# Altium project bailey.PrjPcb (part 11 of 11)
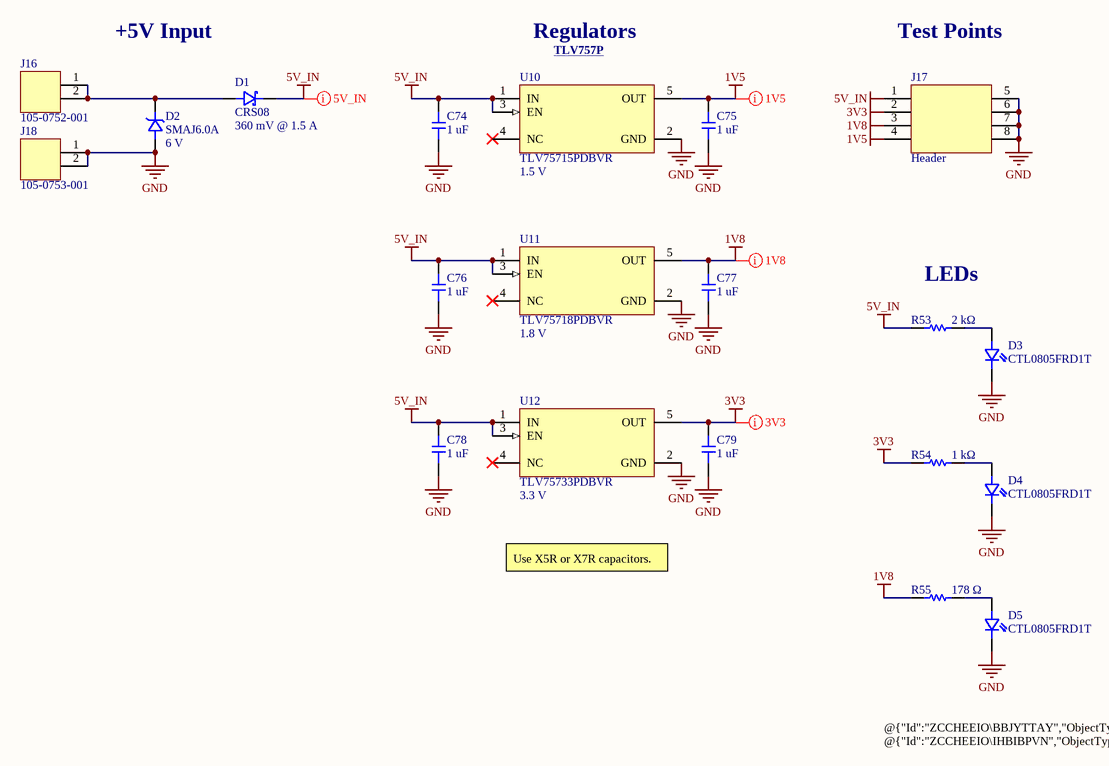
[diagram p15: POWER.SchDoc]

## Sheet POWER.SchDoc (continued)

### Library data of the parts (continued)
U11 = TLV75718PDBVR: 1-A, low-IQ high-accuracy low-dropout (LDO) voltage regulator with enable 5-SOT-23 -40 to 125; Manufacturer: Texas Instruments; Manufacturer Lifecycle Status: ACTIVE; Output Current: 1 A; Accuracy: 1%; Dropout Voltage: 650mV; Max Junction Temperature (Tj): 125°C; Max Supply Voltage: 5.5V; Min Supply Voltage: 1.45V; Nominal Supply Current: 25µA; Number of Channels: 1; Manufacturer Part Number: TLV75718PDBVR; Supplier: DigiKey; Supplier Part Number: 296-50413-1-ND; RoHS: Compliant; Category: LDO Voltage Regulators; Stock: 12647; Pricing: 1=0.33, 10=0.229, 25=0.2032, 100=0.1751, 250=0.16168, 500=0.15358, 1000=0.14692 (USD); Case/Package: SOT-23; Height: 1.45mm; Length: 2.9mm; Lifecycle Status: Production; Max Operating Temperature: 125°C; Min Operating Temperature: -40°C; Number of Outputs: 1; Pins: 5; Schedule B: 8542390000, 8542390000|8542390000|8542390000|8542390000|8542390000; Thickness: 1.2mm; Width: 1.6mm; ComponentLink1URL: https://sigma.octopart.com:443/177332311/technical_drawing/Texas-Instruments-TLV75718PDBVR.pdf?src-supplier=Texas+Instruments; ComponentLink1Description: https://sigma.octopart.com:443/177332311/technical_drawing/Texas-Instruments-TLV75718PDBVR.pdf?src-supplier=Texas+Instruments; ComponentLink2URL: https://octopart.com:443/opatz8j6/c1?t=LNhw8VYZlWpvSgfwSbWwER0C1aFrb4WiDbvbIAGvhxvgQJSu-YTHIYusHOkqrFl1ubYiC7hECb41naNFPdUxKtCiz9_QYZXvTPuT2kWWY7P1iaj_9VuZ0VXU-pOF7midcWATfFw5vckxfwAqZx9Q2ej4q7wKDFH9Xtp9E58D2pRmx7nz-A2MSPhDRcBhv6VVNe5pwxWdv5qqQWIE0Ip5EXAq_TZ793t-Km77zPzDy5oRrzSJqtrEGO8Rg9L3KNyczjw3CqQXp4IaldJF9NwqSrhLVRVV24aJWYeWxK7QEZ1zbLdzfLHpUNGWUx5BArHk98TBn7whuhePb0udLY4hessARU-N37P82AGNs8v-R6eVBy-k_l2R0DXlJserTyRNxdjxCkw&src-supplier=Texas+Instruments; ComponentLink2Description: https://octopart.com:443/opatz8j6/c1?t=LNhw8VYZlWpvSgfwSbWwER0C1aFrb4WiDbvbIAGvhxvgQJSu-YTHIYusHOkqrFl1ubYiC7hECb41naNFPdUxKtCiz9_QYZXvTPuT2kWWY7P1iaj_9VuZ0VXU-pOF7midcWATfFw5vckxfwAqZx9Q2ej4q7wKDFH9Xtp9E58D2pRmx7nz-A2MSPhDRcBhv6VVNe5pwxWdv5qqQWIE0Ip5EXAq_TZ793t-Km77zPzDy5oRrzSJqtrEGO8Rg9L3KNyczjw3CqQXp4IaldJF9NwqSrhLVRVV24aJWYeWxK7QEZ1zbLdzfLHpUNGWUx5BArHk98TBn7whuhePb0udLY4hessARU-N37P82AGNs8v-R6eVBy-k_l2R0DXlJserTyRNxdjxCkw&src-supplier=Texas+Instruments; ComponentLink3URL: https://sigma.octopart.com:443/175570406/technical_drawing/Texas-Instruments-TLV75718PDBVR.pdf?src-supplier=Texas+Instruments; ComponentLink3Description: https://sigma.octopart.com:443/175570406/technical_drawing/Texas-Instruments-TLV75718PDBVR.pdf?src-supplier=Texas+Instruments; ComponentLink4URL: https://sigma.octopart.com:443/169406034/technical_drawing/Texas-Instruments-TLV75718PDBVR.pdf?src-supplier=Texas+Instruments; ComponentLink4Description: https://sigma.octopart.com:443/169406034/technical_drawing/Texas-Instruments-TLV75718PDBVR.pdf?src-supplier=Texas+Instruments; ComponentLink5URL: https://sigma.octopart.com:443/155939316/technical_drawing/Texas-Instruments-TLV75718PDBVR.pdf?src-supplier=Texas+Instruments; ComponentLink5Description: https://sigma.octopart.com:443/155939316/technical_drawing/Texas-Instruments-TLV75718PDBVR.pdf?src-supplier=Texas+Instruments; ComponentLink6URL: https://sigma.octopart.com:443/102331370/technical_drawing/Texas-Instruments-TLV75718PDBVR.pdf?src-supplier=Texas+Instruments; ComponentLink6Description: https://sigma.octopart.com:443/102331370/technical_drawing/Texas-Instruments-TLV75718PDBVR.pdf?src-supplier=Texas+Instruments; ComponentLink7URL: https://datasheet.octopart.com:443/TLV75718PDBVR-Texas-Instruments-datasheet-151190461.pdf?src-supplier=Upverter; ComponentLink7Description: https://datasheet.octopart.com:443/TLV75718PDBVR-Texas-Instruments-datasheet-151190461.pdf?src-supplier=Upverter; ComponentLink8URL: https://datasheet.octopart.com:443/TLV75718PDBVR-Texas-Instruments-datasheet-164419132.pdf?src-supplier=Augswan; ComponentLink8Description: https://datasheet.octopart.com:443/TLV75718PDBVR-Texas-Instruments-datasheet-164419132.pdf?src-supplier=Augswan; ComponentLink9URL: https://datasheet.octopart.com:443/TLV75718PDBVR-Texas-Instruments-datasheet-165804641.pdf?src-supplier=LCSC; ComponentLink9Description: https://datasheet.octopart.com:443/TLV75718PDBVR-Texas-Instruments-datasheet-165804641.pdf?src-supplier=LCSC; ComponentLink10URL: https://datasheet.octopart.com:443/TLV75718PDBVR-Texas-Instruments-datasheet-159117837.pdf?src-supplier=LCSC; ComponentLink10Description: https://datasheet.octopart.com:443/TLV75718PDBVR-Texas-Instruments-datasheet-159117837.pdf?src-supplier=LCSC; ComponentLink11URL: http://sigma.octopart.com:80/reach_statement/Texas-Instruments-company-64.pdf?src-supplier=Compliance+Statements; ComponentLink11Description: http://sigma.octopart.com:80/reach_statement/Texas-Instruments-company-64.pdf?src-supplier=Compliance+Statements; ComponentLink12URL: http://sigma.octopart.com:80/conflict_mineral_statement/Texas-Instruments-company-63.pdf?src-supplier=Compliance+Statements; ComponentLink12Description: http://sigma.octopart.com:80/conflict_mineral_statement/Texas-Instruments-company-63.pdf?src-supplier=Compliance+Statements
U12 = TLV75733PDBVR: 1-A, low-IQ high-accuracy low-dropout (LDO) voltage regulator with enable 5-SOT-23 -40 to 125; Manufacturer: Texas Instruments; Manufacturer Lifecycle Status: ACTIVE; Output Current: 1 A; Accuracy: 1%; Dropout Voltage: 1.35V; Max Junction Temperature (Tj): 125°C; Max Supply Voltage: 5.5V; Min Supply Voltage: 1.45V; Number of Channels: 1; Manufacturer Part Number: TLV75733PDBVR; Supplier: DigiKey; Supplier Part Number: 296-50414-1-ND; RoHS: Compliant; Category: LDO Voltage Regulators; Stock: 9339; Pricing: 1=0.33, 10=0.229, 25=0.2032, 100=0.1751, 250=0.16168, 500=0.15358, 1000=0.14692 (USD); Case/Package: SOT-23; Height: 1.45mm; Length: 2.9mm; Lifecycle Status: Production; Max Operating Temperature: 125°C; Min Operating Temperature: -40°C; Number of Outputs: 1; Pins: 5; Schedule B: 8542390000, 8542390000|8542390000|8542390000|8542390000|8542390000; Thickness: 1.2mm; Width: 1.6mm; ComponentLink1URL: https://sigma.octopart.com:443/177332311/technical_drawing/Texas-Instruments-TLV75733PDBVR.pdf?src-supplier=Texas+Instruments; ComponentLink1Description: https://sigma.octopart.com:443/177332311/technical_drawing/Texas-Instruments-TLV75733PDBVR.pdf?src-supplier=Texas+Instruments; ComponentLink2URL: https://octopart.com:443/opatz8j6/c1?t=o_IEZOOxq13ZapM8h6eyVu6U4w7uJ0lOpdn1eQGus_LxPlF5140NiI_IzcwdUYrJ31K3ZwQ0inlTMb17Fre9UGVV-cyueG3giZtsqNdfBTaDvWHPrUnuYqbjGGi1Ds2698qqLwV3Tlrub6HkjX8UNxdzrCQv7HZbxbhh4yUVoxpAQ1qsH8ZXaPiP3z0geKqV9LoOfem8uzwcPRQneIzB8HlYy48TGA3XJ2QdRU4asiXFDExmiO-kVw1cCOAyjCAZDaRc6pkHeHkCvnc9-OsSmWRnTJK9cYXxUvWANDQacA2frlSUhGVJAUMlyqJStMqs6xJQSWGFCunWce9bwDnK-mHRtMdijleQcFxXiu3YZMz3tjqIGqvB3GT98ijRk5E9binYeYc&src-supplier=Texas+Instruments; ComponentLink2Description: https://octopart.com:443/opatz8j6/c1?t=o_IEZOOxq13ZapM8h6eyVu6U4w7uJ0lOpdn1eQGus_LxPlF5140NiI_IzcwdUYrJ31K3ZwQ0inlTMb17Fre9UGVV-cyueG3giZtsqNdfBTaDvWHPrUnuYqbjGGi1Ds2698qqLwV3Tlrub6HkjX8UNxdzrCQv7HZbxbhh4yUVoxpAQ1qsH8ZXaPiP3z0geKqV9LoOfem8uzwcPRQneIzB8HlYy48TGA3XJ2QdRU4asiXFDExmiO-kVw1cCOAyjCAZDaRc6pkHeHkCvnc9-OsSmWRnTJK9cYXxUvWANDQacA2frlSUhGVJAUMlyqJStMqs6xJQSWGFCunWce9bwDnK-mHRtMdijleQcFxXiu3YZMz3tjqIGqvB3GT98ijRk5E9binYeYc&src-supplier=Texas+Instruments; ComponentLink3URL: https://sigma.octopart.com:443/175570406/technical_drawing/Texas-Instruments-TLV75733PDBVR.pdf?src-supplier=Texas+Instruments; ComponentLink3Description: https://sigma.octopart.com:443/175570406/technical_drawing/Texas-Instruments-TLV75733PDBVR.pdf?src-supplier=Texas+Instruments; ComponentLink4URL: https://sigma.octopart.com:443/169406034/technical_drawing/Texas-Instruments-TLV75733PDBVR.pdf?src-supplier=Texas+Instruments; ComponentLink4Description: https://sigma.octopart.com:443/169406034/technical_drawing/Texas-Instruments-TLV75733PDBVR.pdf?src-supplier=Texas+Instruments; ComponentLink5URL: https://sigma.octopart.com:443/155939316/technical_drawing/Texas-Instruments-TLV75733PDBVR.pdf?src-supplier=Texas+Instruments; ComponentLink5Description: https://sigma.octopart.com:443/155939316/technical_drawing/Texas-Instruments-TLV75733PDBVR.pdf?src-supplier=Texas+Instruments; ComponentLink6URL: https://sigma.octopart.com:443/102331370/technical_drawing/Texas-Instruments-TLV75733PDBVR.pdf?src-supplier=Texas+Instruments; ComponentLink6Description: https://sigma.octopart.com:443/102331370/technical_drawing/Texas-Instruments-TLV75733PDBVR.pdf?src-supplier=Texas+Instruments; ComponentLink7URL: https://datasheet.octopart.com:443/TLV75733PDBVR-Texas-Instruments-datasheet-164419132.pdf?src-supplier=Augswan; ComponentLink7Description: https://datasheet.octopart.com:443/TLV75733PDBVR-Texas-Instruments-datasheet-164419132.pdf?src-supplier=Augswan; ComponentLink8URL: https://datasheet.octopart.com:443/TLV75733PDBVR-Texas-Instruments-datasheet-165804641.pdf?src-supplier=LCSC; ComponentLink8Description: https://datasheet.octopart.com:443/TLV75733PDBVR-Texas-Instruments-datasheet-165804641.pdf?src-supplier=LCSC; ComponentLink9URL: https://datasheet.octopart.com:443/TLV75733PDBVR-Texas-Instruments-datasheet-159117837.pdf?src-supplier=LCSC; ComponentLink9Description: https://datasheet.octopart.com:443/TLV75733PDBVR-Texas-Instruments-datasheet-159117837.pdf?src-supplier=LCSC; ComponentLink10URL: http://sigma.octopart.com:80/reach_statement/Texas-Instruments-company-64.pdf?src-supplier=Compliance+Statements; ComponentLink10Description: http://sigma.octopart.com:80/reach_statement/Texas-Instruments-company-64.pdf?src-supplier=Compliance+Statements; ComponentLink11URL: http://sigma.octopart.com:80/conflict_mineral_statement/Texas-Instruments-company-63.pdf?src-supplier=Compliance+Statements; ComponentLink11Description: http://sigma.octopart.com:80/conflict_mineral_statement/Texas-Instruments-company-63.pdf?src-supplier=Compliance+Statements

## Sheet MCU.SchDoc
size Letter; DrawnBy: Titan Yuan; DocumentNumber: 7; SheetNumber: 7; SheetTotal: 7
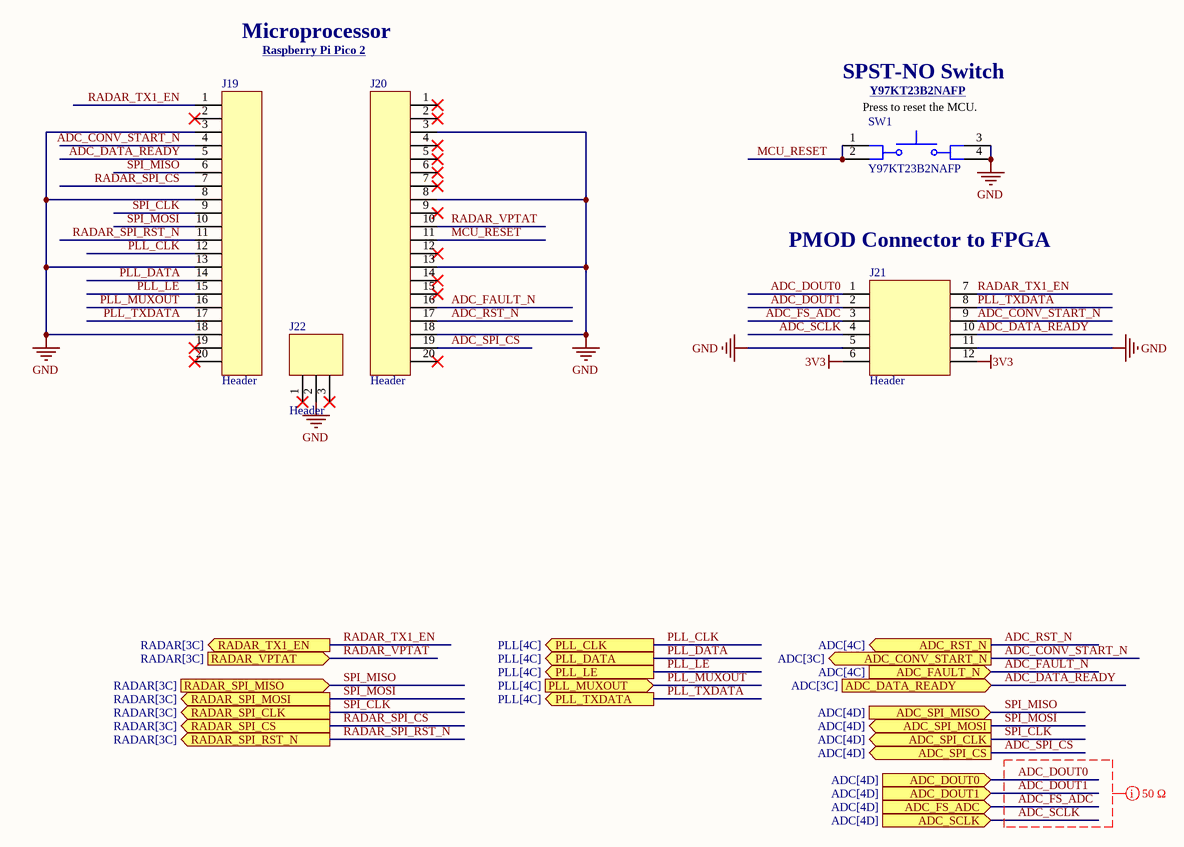
[diagram p6: MCU.SchDoc]

### Parts
J19  Header  [CONN_1x20_2.54mm_PinSocket_Vertical]
J20  Header  [CONN_1x20_2.54mm_PinSocket_Vertical]
J21  Header  [CONN_2x6_2.54mm_PinHeader_Horizontal]
J22  Header  [CONN_1x3_2.54mm_PinSocket_Vertical]
SW1  Y97KT23B2NAFP  [PTS647]

### Ports
ADC_CONV_START_N (out, see ADC[3C]), ADC_DATA_READY (in, see ADC[3C]), ADC_DOUT0 (in, see ADC[4D]), ADC_DOUT1 (in, see ADC[4D]), ADC_FAULT_N (in, see ADC[4C]), ADC_FS_ADC (in, see ADC[4D]), ADC_RST_N (out, see ADC[4C]), ADC_SCLK (in, see ADC[4D]), ADC_SPI_CLK (out, see ADC[4D]), ADC_SPI_CS (out, see ADC[4D]), ADC_SPI_MISO (in, see ADC[4D]), ADC_SPI_MOSI (out, see ADC[4D]), PLL_CLK (out, see PLL[4C]), PLL_DATA (out, see PLL[4C]), PLL_LE (out, see PLL[4C]), PLL_MUXOUT (in, see PLL[4C]), PLL_TXDATA (out, see PLL[4C]), RADAR_SPI_CLK (out, see RADAR[3C]), RADAR_SPI_CS (out, see RADAR[3C]), RADAR_SPI_MISO (in, see RADAR[3C]), RADAR_SPI_MOSI (out, see RADAR[3C]), RADAR_SPI_RST_N (out, see RADAR[3C]), RADAR_TX1_EN (out, see RADAR[3C]), RADAR_VPTAT (in, see RADAR[3C])

### Nets
3V3: J21.6 J21.12  [project net AVDD]
GND: J19.3 J19.8 J19.13 J19.18 J20.3 J20.8 J20.13 J20.18 J21.5 J21.11 J22.2 SW1.3 SW1.4
ADC_CONV_START_N: J19.4 J21.9 ; port ADC_CONV_START_N
ADC_DATA_READY: J19.5 J21.10 ; port ADC_DATA_READY
ADC_DOUT0: J21.1 ; port ADC_DOUT0
ADC_DOUT1: J21.2 ; port ADC_DOUT1
ADC_FAULT_N: J20.16 ; port ADC_FAULT_N
ADC_FS_ADC: J21.3 ; port ADC_FS_ADC
ADC_RST_N: J20.17 ; port ADC_RST_N
ADC_SCLK: J21.4 ; port ADC_SCLK
ADC_SPI_CS: J20.19 ; port ADC_SPI_CS
MCU_RESET: J20.11 SW1.1 SW1.2  [project net MCU_RESET_7]
PLL_CLK: J19.12 ; port PLL_CLK
PLL_DATA: J19.14 ; port PLL_DATA
PLL_LE: J19.15 ; port PLL_LE
PLL_MUXOUT: J19.16 ; port PLL_MUXOUT
PLL_TXDATA: J19.17 J21.8 ; port PLL_TXDATA
RADAR_SPI_CS: J19.7 ; port RADAR_SPI_CS
RADAR_SPI_RST_N: J19.11 ; port RADAR_SPI_RST_N
RADAR_TX1_EN: J19.1 J21.7 ; port RADAR_TX1_EN
RADAR_VPTAT: J20.10 ; port RADAR_VPTAT
SPI_CLK: J19.9 ; port RADAR_SPI_CLK, port ADC_SPI_CLK  [project net ADC_SPI_CLK]
SPI_MISO: J19.6 ; port RADAR_SPI_MISO, port ADC_SPI_MISO  [project net ADC_SPI_MISO]
SPI_MOSI: J19.10 ; port RADAR_SPI_MOSI, port ADC_SPI_MOSI  [project net ADC_SPI_MOSI]

Not connected (* = marked no-connect by the designer): J19 2* 19* 20*; J20 1* 2* 4* 5* 6* 7* 9* 12* 14* 15* 20*; J22 1* 3*

### Layout directives
net class 50 Ω: ADC_DOUT0, ADC_DOUT1, ADC_FS_ADC, ADC_SCLK

### Notes on the sheet
- Microprocessor
- Raspberry Pi Pico 2 <https://www.raspberrypi.com/products/raspberry-pi-pico-2/>
- SPST-NO Switch
- (near SW1) Press to reset the MCU.
- (near SW1) Y97KT23B2NAFP <https://www.ckswitches.com/media/2567/pts647.pdf>
- (near J21) PMOD Connector to FPGA

### Library data of the parts
J19 J20 = CONN_1x20_2.54mm_PinSocket_Vertical: WR-PHD 2.54 mm Socket Header; 20 pins; Manufacturer: Wurth Elektronik; Manufacturer Part Number: 61302011821; Contact Resistance: 20mΩ; Current Rating: 3A; Gender: Female; Insulation Resistance: 1GΩ; Operating Supply Voltage: 250V; Pitch: 2.54mm; Supplier: DigiKey; Supplier Part Number: 732-61302011821-ND; RoHS: Compliant; Category: Connectors; Stock: 9205; Pricing: 1=0.83, 25=0.7508, 100=0.7038, 250=0.6534, 500=0.6048, 1000=0.5058 (USD); Contact Plating: Gold; Insulation Material: PBT; Lead Pitch: 2.54mm; Length: 51.3mm; Max Operating Temperature: 105°C; Min Operating Temperature: -40°C; Pins: 20; Orientation: Vertical; ComponentLink1URL: https://datasheet.octopart.com:443/61302011821-Wurth-Elektronik-datasheet-182028588.pdf?src-supplier=Wurth+Elektronik; ComponentLink1Description: https://datasheet.octopart.com:443/61302011821-Wurth-Elektronik-datasheet-182028588.pdf?src-supplier=Wurth+Elektronik; ComponentLink2URL: https://datasheet.octopart.com:443/61302011821-W%C3%BCrth-Elektronik-datasheet-62127820.pdf?src-supplier=Wurth+Elektronik; ComponentLink2Description: https://datasheet.octopart.com:443/61302011821-W%C3%BCrth-Elektronik-datasheet-62127820.pdf?src-supplier=Wurth+Elektronik; ComponentLink3URL: https://datasheet.octopart.com:443/61302011821-W%C3%BCrth-Elektronik-datasheet-149524182.pdf?src-supplier=Farnell; ComponentLink3Description: https://datasheet.octopart.com:443/61302011821-W%C3%BCrth-Elektronik-datasheet-149524182.pdf?src-supplier=Farnell
J21 = CONN_2x6_2.54mm_PinHeader_Horizontal: Conn Unshrouded Header HDR 12 POS 2.54mm Solder RA Top Entry Thru-Hole Bag; Manufacturer: Adam Tech; Manufacturer Part Number: PH2RA-12-UA; Contact Resistance: 20mΩ; Current Rating: 3A; Insulation Resistance: 5GΩ; Supplier: DigiKey; Supplier Part Number: 2057-PH2RA-12-UA-ND; RoHS: Compliant; Category: Card Edge Connectors; Stock: 5214; Pricing: 1=0.27, 10=0.229, 100=0.1945, 500=0.17358, 1000=0.16528, 5000=0.14753, 10000=0.14049 (USD); Contact Gender: Male; Contact Material: Brass; Export Control Classification Number (ECCN) Code: EAR99; Harmonized Tariff Schedule (HTS) Code: 8536.69.40.40; Introduction Date: 2012-01-13; Lifecycle Status: Production; Max Operating Temperature: 105°C; Min Operating Temperature: -40°C; Pins: 12; Number of Rows: 2; REACH SVHC: Yes; Row Spacing: 2.54mm; Schedule B: 8536694040, 8536694040|8536694040|8536694040|8536694040|8536694040; Terminal Pitch: 2.54mm; ComponentLink1URL: https://datasheet.octopart.com:443/PH2RA-12-UA-Adam-Tech-datasheet-21182894.pdf?src-supplier=IHS; ComponentLink1Description: https://datasheet.octopart.com:443/PH2RA-12-UA-Adam-Tech-datasheet-21182894.pdf?src-supplier=IHS; ComponentLink2URL: http://sigma.octopart.com:80/reach_statement/Adam-Tech-company-23.pdf?src-supplier=Compliance+Statements; ComponentLink2Description: http://sigma.octopart.com:80/reach_statement/Adam-Tech-company-23.pdf?src-supplier=Compliance+Statements; ComponentLink3URL: http://sigma.octopart.com:80/rohs_statement/Adam-Tech-company-22.pdf?src-supplier=Compliance+Statements; ComponentLink3Description: http://sigma.octopart.com:80/rohs_statement/Adam-Tech-company-22.pdf?src-supplier=Compliance+Statements
J22 = CONN_1x3_2.54mm_PinSocket_Vertical: Btb Conn, Rcpt, 3Pos, 1Row, 2.54Mm Rohs Compliant: Yes |Wurth Elektronik 61300311821; Contact Resistance: 20mΩ; Current Rating: 3A; Gender: Female; Insulation Resistance: 1GΩ; Operating Supply Voltage: 250V; Manufacturer: Wurth Elektronik; Manufacturer Part Number: 61300311821; Supplier: DigiKey; Supplier Part Number: 732-61300311821-ND; RoHS: Compliant; Category: Uncategorized; Stock: 1715; Pricing: 1=0.32, 10=0.303, 100=0.2916, 250=0.27992, 500=0.2673 (USD); Contact Plating: Gold; Insulation Material: PBT; Lead Pitch: 2.54mm; Length: 8.12mm; Max Operating Temperature: 105°C; Min Operating Temperature: -40°C; Pins: 3; Orientation: Vertical; Pitch: 2.54mm; ComponentLink1URL: https://datasheet.octopart.com:443/61300311821-Wurth-Elektronik-datasheet-182028583.pdf?src-supplier=Wurth+Elektronik; ComponentLink1Description: https://datasheet.octopart.com:443/61300311821-Wurth-Elektronik-datasheet-182028583.pdf?src-supplier=Wurth+Elektronik; ComponentLink2URL: https://datasheet.octopart.com:443/61300311821-W%C3%BCrth-Elektronik-datasheet-62127820.pdf?src-supplier=Wurth+Elektronik; ComponentLink2Description: https://datasheet.octopart.com:443/61300311821-W%C3%BCrth-Elektronik-datasheet-62127820.pdf?src-supplier=Wurth+Elektronik
SW1 = Y97KT23B2NAFP: Switch Tactile OFF Mom SPST Round Button Gull Wing 50mA 12VDC 100000Cycles 1.77N Surface Mount T/R; Manufacturer: C&K; Bounce Time: <=5 ms; Contact Resistance: 100 mΩ; Electrical Life: 100kcycles; Max Voltage Rating (DC): 12V; Number of Positions: 1; Operating Force: 2.26N; Manufacturer Part Number: Y97KT23B2NAFP; Maximum Voltage: 12 VDC; Maximum Current: 50 mA; Insulation Resistance: 100 MΩ; Supplier: DigiKey; Supplier Part Number: 108-PTS647SM38SMTR2LFSCT-ND; RoHS: Compliant; Category: Tactile Switches; Stock: 37245; Pricing: 1=0.26, 10=0.226, 25=0.2116, 100=0.1897, 250=0.17588, 500=0.16596, 1000=0.15666 (USD); Contact Current Rating: 50mA; Country of Origin: Mainland China; Export Control Classification Number (ECCN) Code: EAR99; Height: 2.9mm; Harmonized Tariff Schedule (HTS) Code: 8536.50.90.40; Introduction Date: 2019-06-11; Length: 4.5mm; Life (Cycles): 100kcycles; Lifecycle Status: Production; Max Current Rating: 50mA; Max Operating Temperature: 70°C; Min Operating Temperature: -40°C; Mounting Technology: Surface Mount; REACH SVHC: Yes; Schedule B: 8536509065, 8536509065|8536509065, 8536509065|8536509065|8536509065, 8536509065|8536509065|8536509065|8536509065; Throw Configuration: SPST; Voltage Rating (DC): 12V; ComponentLink1URL: https://datasheet.octopart.com:443/PTS647SM38SMTR2LFS-C%26K-Components-datasheet-180017464.pdf?src-supplier=IHS; ComponentLink1Description: https://datasheet.octopart.com:443/PTS647SM38SMTR2LFS-C%26K-Components-datasheet-180017464.pdf?src-supplier=IHS; ComponentLink2URL: https://datasheet.octopart.com:443/PTS647SM38SMTR2LFS-C%26K-Components-datasheet-117317067.pdf?src-supplier=Future+Electronics; ComponentLink2Description: https://datasheet.octopart.com:443/PTS647SM38SMTR2LFS-C%26K-Components-datasheet-117317067.pdf?src-supplier=Future+Electronics; ComponentLink3URL: https://datasheet.octopart.com:443/PTS647SM38SMTR2-LFS-C%26K-Components-datasheet-175422368.pdf?src-supplier=Farnell; ComponentLink3Description: https://datasheet.octopart.com:443/PTS647SM38SMTR2-LFS-C%26K-Components-datasheet-175422368.pdf?src-supplier=Farnell; ComponentLink4URL: https://datasheet.octopart.com:443/PTS647SM38SMTR2LFS-C%26K-Components-datasheet-145017121.pdf?src-supplier=Electro+Sonic; ComponentLink4Description: https://datasheet.octopart.com:443/PTS647SM38SMTR2LFS-C%26K-Components-datasheet-145017121.pdf?src-supplier=Electro+Sonic; ComponentLink5URL: https://datasheet.octopart.com:443/PTS-647-SM38-SMTR2-LFS-C%26K-Components-datasheet-119449707.pdf?src-supplier=RS+(Formerly+Allied+Electronics); ComponentLink5Description: https://datasheet.octopart.com:443/PTS-647-SM38-SMTR2-LFS-C%26K-Components-datasheet-119449707.pdf?src-supplier=RS+(Formerly+Allied+Electronics)

## Nets that join several sheets
1V5: RADAR (13 pins), POWER (C75.2 J17.4 U10.5)
1V8: PLL (11 pins), POWER (C77.2 J17.3 R55.1 U11.5)
AVDD: RADAR (C8.2 U2.19), IF (C9.1 C10.1 U3.4 U4.4), PLL (10 pins), ADC (30 pins), OSC (7 pins), POWER (C79.2 J17.2 R54.1 U12.5), MCU (J21.6 J21.12)
GND: RADAR (39 pins), IF (20 pins), PLL (26 pins), ADC (41 pins), OSC (7 pins), POWER (19 pins), MCU (13 pins)
ADC_CONV_START_N: ADC (J14.1 R41.1 U7.35), MCU (J19.4 J21.9)
ADC_DATA_READY: ADC (J14.4 U7.22), MCU (J19.5 J21.10)
ADC_DOUT0: ADC (R38.2), MCU (J21.1)
ADC_DOUT1: ADC (R39.2), MCU (J21.2)
ADC_FAULT_N: ADC (J14.2 R42.1 U7.42), MCU (J20.16)
ADC_FS_ADC: ADC (R47.1), MCU (J21.3)
ADC_MCLKIN: ADC (U7.16), OSC (R51.2)
ADC_RST_N: ADC (J14.3 R43.1 U7.43), MCU (J20.17)
ADC_SCLK: ADC (R40.2), MCU (J21.4)
ADC_SPI_CLK: RADAR (U2.17), ADC (U7.40), MCU (J19.9)
ADC_SPI_CS: ADC (R44.1 U7.41), MCU (J20.19)
ADC_SPI_MISO: RADAR (U2.15), ADC (U7.38), MCU (J19.6)
ADC_SPI_MOSI: RADAR (U2.18), ADC (U7.39), MCU (J19.10)
PLL_CLK: PLL (U6.18), MCU (J19.12)
PLL_DATA: PLL (U6.17), MCU (J19.14)
PLL_LE: PLL (U6.16), MCU (J19.15)
PLL_MUXOUT: PLL (U6.15), MCU (J19.16)
PLL_REFIN: PLL (C14.2), OSC (R50.2)
PLL_TXDATA: PLL (U5.12), MCU (J19.17 J21.8)
RADAR_IF1I_N: RADAR (U1.J7), IF (TP2.1 U3.5), ADC (C60.1)
RADAR_IF1I_P: RADAR (U1.J8), IF (TP1.1 U3.3), ADC (C58.1)
RADAR_IF1Q_N: RADAR (U1.G9), IF (TP4.1 U3.12), ADC (C63.1)
RADAR_IF1Q_P: RADAR (U1.H9), IF (TP3.1 U3.10), ADC (C61.1)
RADAR_IF2I_N: RADAR (U1.A7), IF (TP6.1 U4.5), ADC (C66.1)
RADAR_IF2I_P: RADAR (U1.A8), IF (TP5.1 U4.3), ADC (C64.1)
RADAR_IF2Q_N: RADAR (U1.C9), IF (TP8.1 U4.12), ADC (C69.1)
RADAR_IF2Q_P: RADAR (U1.B9), IF (TP7.1 U4.10), ADC (C67.1)
RADAR_LO_DIV: RADAR (U1.C1), PLL (C17.2)
RADAR_SPI_CS: RADAR (U2.14), MCU (J19.7)
RADAR_SPI_RST_N: RADAR (U2.16), MCU (J19.11)
RADAR_TX1_EN: RADAR (J4.4 U2.13), MCU (J19.1 J21.7)
RADAR_VPTAT: RADAR (C6.2 J4.1 R4.1 U1.A3), MCU (J20.10)
RADAR_VTUNE: RADAR (J4.2 R3.2), PLL (C26.1 J13.1 R31.1)